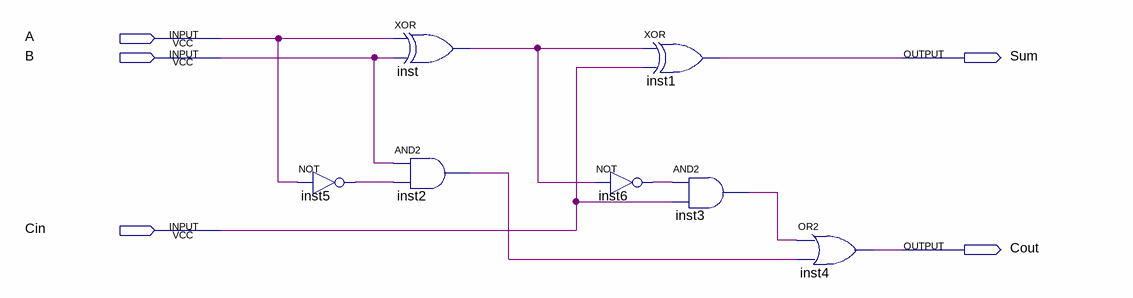
[diagram p0: schematic sheet]
// Quartus schematic fas.bdf as structural Verilog: 7 symbols, 5 pins
module fas (
  input  A,
  input  B,
  input  Cin,
  output Sum,
  output Cout
);

  wire inst2_out, inst3_out, inst5_out, inst6_out, inst_out;

  not inst5 (inst5_out, A);
  xor inst (inst_out, A, B);
  and inst2 (inst2_out, B, inst5_out);
  not inst6 (inst6_out, inst_out);
  xor inst1 (Sum, inst_out, Cin);
  and inst3 (inst3_out, inst6_out, Cin);
  or inst4 (Cout, inst3_out, inst2_out);
endmodule
